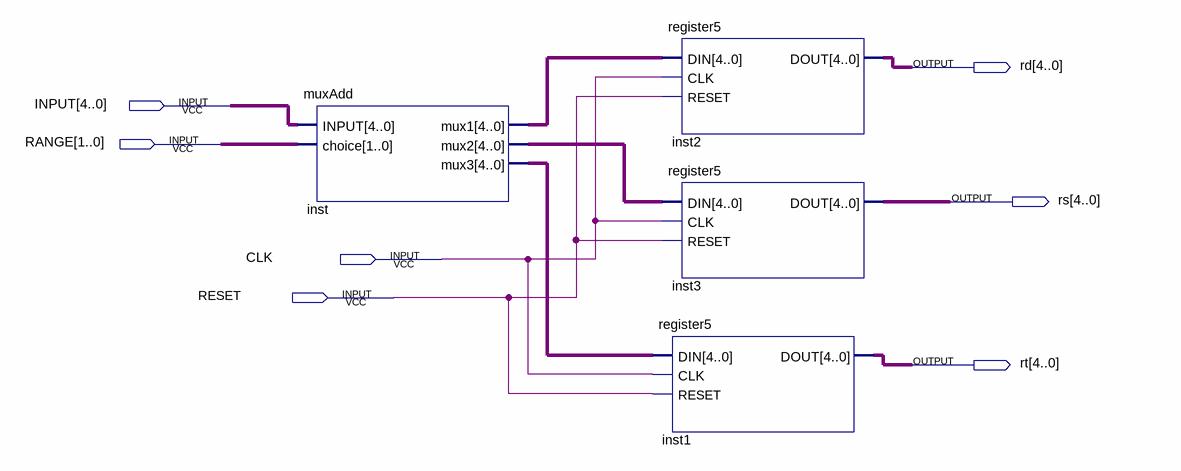
[diagram p0: schematic sheet]
// Quartus schematic addressBuffer.bdf as structural Verilog: 4 symbols, 7 pins
module addressBuffer (
  input  [4:0] INPUT,
  input  [1:0] RANGE,
  input  CLK,
  input  RESET,
  output [4:0] rd,
  output [4:0] rs,
  output [4:0] rt
);

  wire [4:0] inst_mux1, inst_mux2, inst_mux3;

  muxAdd inst (.INPUT(INPUT), .choice(RANGE), .mux1(inst_mux1), .mux2(inst_mux2), .mux3(inst_mux3));
  register5 inst2 (.DIN(inst_mux1), .CLK(CLK), .RESET(RESET), .DOUT(rd));
  register5 inst3 (.DIN(inst_mux2), .CLK(CLK), .RESET(RESET), .DOUT(rs));
  register5 inst1 (.DIN(inst_mux3), .CLK(CLK), .RESET(RESET), .DOUT(rt));
endmodule
